# Altium schematic sheet encoder.SchDoc
size A4
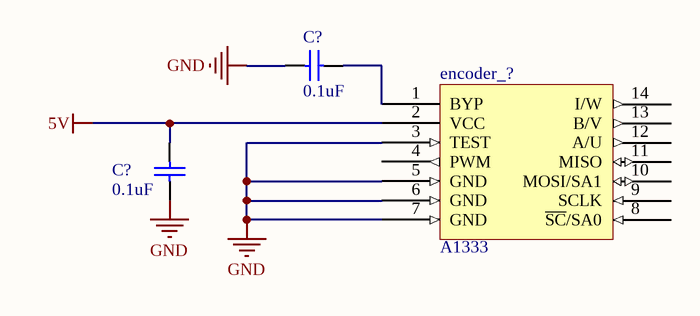
[diagram p0: encoder.SchDoc]

## Parts
(Parts that share a designator on the sheet are numbered #1, #2 ... from top to bottom, then left to right.)
C?#1  0.1uF  [FP_0402_CAP_050]
C?#2  0.1uF  [FP_0402_CAP_050]
encoder_?  A1333

## Nets
5V: C?#2.2 encoder_?.2(VCC)
GND: C?#1.1 C?#2.1 encoder_?.3(TEST) encoder_?.5(GND) encoder_?.6(GND) encoder_?.7(GND)
NetC?#1_2: C?#1.2 encoder_?.1(BYP)

Not connected (* = marked no-connect by the designer): encoder_? 4(PWM) 8(~{SC}/SA0) 9(SCLK) 10(MOSI/SA1) 11(MISO) 12(A/U) 13(B/V) 14(I/W)

## Library data of the parts
C?#1 C?#2 = CAP: Capacitor; Value: 0.1uF
encoder_? = A1333: Allegro encoder